# EAGLE schematic power (EAGLE 9.5.1)
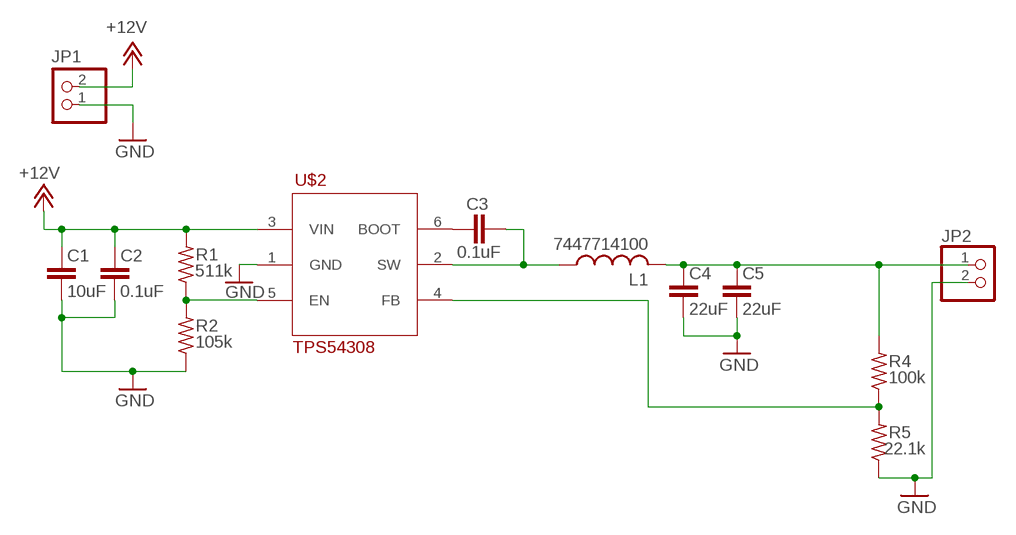
[diagram p0: schematic, sheet 1]

## Parts
C1  10uF  C-EUC2012  [C2012]
C2  0.1uF  C-EUC2012  [C2012]
C3  0.1uF  C-EUC2012  [C2012]
C4  22uF  C-EUC2012  [C2012]
C5  22uF  C-EUC2012  [C2012]
JP1  PINHD-1X2  [1X02]
JP2  PINHD-1X2  [1X02]
L1  7447714100  [7447714100]
R1  511k  R-US_R0805  [R0805]
R2  105k  R-US_R0805  [R0805]
R4  100k  R-US_R0805  [R0805]
R5  22.1k  R-US_R0805  [R0805]
U$2  TPS54308  [SOT-23-6]

## Nets
+12V: C1.1 C2.1 JP1.2 R1.2 U$2.3(VIN)
GND: C1.2 C2.2 C4.2 C5.2 JP1.1 JP2.2 R2.1 R5.1 U$2.1(GND)
N$1: R1.1 R2.2 U$2.5(EN)
N$2: C3.1 U$2.6(BOOT)
N$3: C3.2 L1.P$1 U$2.2(SW)
N$4: C4.1 C5.1 JP2.1 L1.P$2 R4.2
N$8: R4.1 R5.2 U$2.4(FB)

## Library data of the parts
C1-C5 = rcl:C-EU: CAPACITOR, European symbol; SPICEPREFIX: C
JP1 JP2 = pinhead:PINHD-1X2: PIN HEADER
L1 = chava:7447714100
R1 R2 R4 R5 = rcl:R-US_: RESISTOR, American symbol; SPICEPREFIX: R
U$2 = Spaceshot_Custom:TPS54308